# Altium schematic sheet 4_Port_多余的.schdoc.schdoc
size 302 x 215 mm; Name: A_A4; Symbol: A_A4; Device: A_A4; @Project Name: 0117_230627_uMSX 4.0; REV: 1.0; Date: 2023-01-30; Sheet: 1/1; Draw By: Denjhang; Company: Your Company; Convert to PCB: yes; Add into BOM: yes
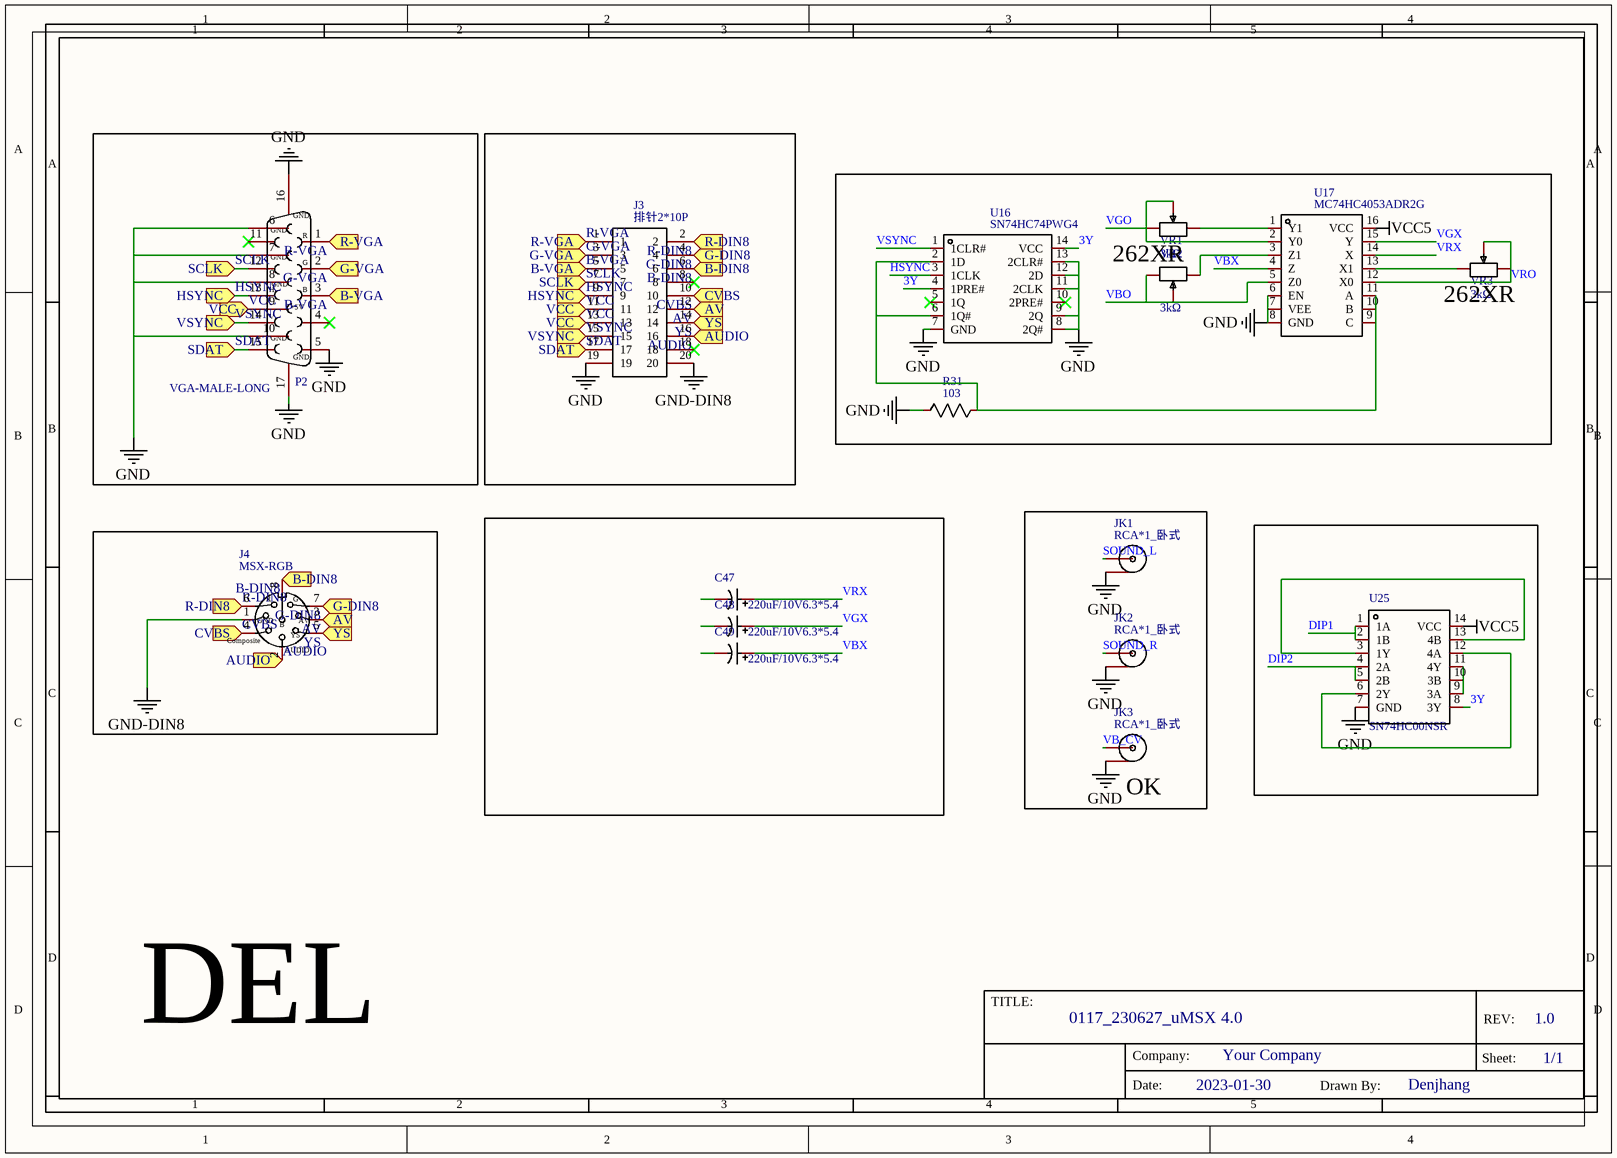
[diagram p0: 4_Port_多余的.schdoc.schdoc]

## Parts
C47  220uF/10V6.3*5.4  [CAP-SMD_BD6.3-L6.6-W6.6-LS7.2-FD]
C48  220uF/10V6.3*5.4  [CAP-SMD_BD6.3-L6.6-W6.6-LS7.2-FD]
C49  220uF/10V6.3*5.4  [CAP-SMD_BD6.3-L6.6-W6.6-LS7.2-FD]
J3  排针2*10P  [排针2*10P]
J4  MSX-RGB  [MSX-RGB]
JK1  RCA*1_卧式  [RCA*1卧式]
JK2  RCA*1_卧式  [RCA*1卧式]
JK3  RCA*1_卧式  [RCA*1卧式]
P2  VGA-MALE-LONG  [VGA-MALE-LONG]
R31  103  [R0603]
U16  SN74HC74PWG4  [SOP-14_L8.6-W3.9-P1.27-LS6.0-BL]
U17  MC74HC4053ADR2G  [SOP-16_L10.2-W3.9-P1.27-LS6.0-BL]
U25  SN74HC00NSR  [SOP-14_L8.6-W3.9-P1.27-LS6.0-BL]
VR1  3kΩ  [RES-ADJ-SMD_3P-L3.10-W3.80-P1.00]
VR2  3kΩ  [RES-ADJ-SMD_3P-L3.10-W3.80-P1.00]
VR3  3kΩ  [RES-ADJ-SMD_3P-L3.10-W3.80-P1.00]

## Blocks framed on the sheet
OK: JK1-JK3

## Ports
AUDIO (in), AV (in), B-DIN8 (in), B-VGA (in), CVBS (in), G-DIN8 (in), G-VGA (in), HSYNC (in), R-DIN8 (in), R-VGA (in), SCLK (in), SDAT (in), VCC (in), VSYNC (in), YS (in)

## Nets
GND: J3.19 JK1.3 JK2.3 JK3.3 P2.5 P2.6 P2.7 P2.8 P2.10 P2.16 P2.17 R31.1 U16.7(GND) U16.8(2Q#) U16.9(2Q) U16.11(2CLK) U16.12(2D) U16.13(2CLR#) U17.6(EN) U17.7(VEE) U17.8(GND) U25.7(GND)
GND-DIN8: J3.20 J4.1
VCC5: U17.16(VCC) U25.14(VCC)
3Y: U16.4(1PRE#) U16.14(VCC) U25.8(3Y)
AUDIO: J3.16 J4.2 ; port AUDIO
AV: J3.12 J4.3 ; port AV
B-DIN8: J3.6 J4.8 ; port B-DIN8
B-VGA: J3.5 P2.3 ; port B-VGA
CVBS: J3.10 J4.4 ; port CVBS
DIP1: U25.1(1A) U25.2(1B)
DIP2: U25.4(2A) U25.5(2B)
G-DIN8: J3.4 J4.7 ; port G-DIN8
G-VGA: J3.3 P2.2 ; port G-VGA
HSYNC: J3.9 P2.13 U16.3(1CLK) ; port HSYNC
R-DIN8: J3.2 J4.6 ; port R-DIN8
R-VGA: J3.1 P2.1 ; port R-VGA
SCLK: J3.7 P2.12 ; port SCLK
SDAT: J3.17 P2.15 ; port SDAT
SOUND_L: JK1.2
SOUND_R: JK2.2
VB_CV: JK3.2
VBO: U17.5(Z0) VR2.a VR2.b
VBX: C49.1 U17.4(Z)
VCC: J3.11 J3.13 P2.9 ; port VCC
VGO: U17.2(Y0) VR1.b VR1.c
VGX: C48.1 U17.15(Y)
VRO: U17.12(X0) VR3.a VR3.b
VRX: C47.1 U17.14(X)
VSYNC: J3.15 P2.14 U16.1(1CLR#) ; port VSYNC
YS: J3.14 J4.5 ; port YS
NetR31_2: R31.2 U16.2(1D) U16.6(1Q#) U17.9(C) U17.10(B) U17.11(A)
NetU17_1: U17.1(Y1) VR1.a
NetU17_3: U17.3(Z1) VR2.c
NetU17_13: U17.13(X1) VR3.c
NetU25_3: U25.3(1Y) U25.13(4B)
NetU25_6: U25.6(2Y) U25.12(4A)
NetU25_9: U25.9(3A) U25.10(3B) U25.11(4Y)

Not connected (* = marked no-connect by the designer): C47 2; C48 2; C49 2; J3 8* 18*; P2 4* 11*; U16 5(1Q)* 10(2PRE#)*

## Notes on the sheet
- 262XR
- (near VR3) 262XR
- DEL
- 1
- 2
- 3
- 4
- 5
- A
- B
- C
- D
- TITLE:
- 0117_230627_uMSX 4.0
- REV:
- 1.0
- Date:
- Company:
- 2023-01-30
- Your Company
- Drawn By:
- Denjhang
- Sheet:
- 1/1
- (in symbol MSX-RGB) R; G; GND; AV; B; YS; Composite; AUDIO
- (in symbol VGA-MALE-LONG) GND; R; G; H; B; +5V; V

## Library data of the parts
C47-C49 = 固态电容220uF/10V6.3*5.4: Add into BOM: yes; Name: 220uF/10V6.3*5.4; Symbol: 固态电容220UF/10V6.3*5.4; Device: 固态电容220uF/10V6.3*5.4; LCSC Part Name: 固态电容220uF/10V6.3*5.4; Supplier Part: C9900001736; Manufacturer Part: 220uF/10V6.3*5.4; Supplier Footprint: CAP-SMD_6.3X5.4; JLCPCB Part Class: Extended Part; Datasheet: https://atta.szlcsc.comnull; Supplier: LCSC; Convert to PCB: yes
J3 = 排针2*10P: Convert to PCB: yes; Name: 排针2*10P; Symbol: 排针2*10P; Device: 排针2*10P; Add into BOM: yes; Origin Footprint: 排针2*10P
J4 = MSX-RGB: Convert to PCB: yes; Name: MSX-RGB; Symbol: MSX-RGB; Device: MSX-RGB; Add into BOM: yes; Origin Footprint: MSX-RGB
JK1-JK3 = RCA*1_卧式: 3DModel: rca座; Add into BOM: yes; Name: RCA*1_卧式; Symbol: RCA*1_卧式; Device: RCA*1_卧式; Convert to PCB: yes; Origin Footprint: RCA*1卧式
P2 = VGA-MALE-LONG: Convert to PCB: yes; Name: VGA-MALE-LONG; Symbol: VGA-MALE-LONG; Device: VGA-MALE-LONG; Add into BOM: yes; Origin Footprint: VGA-MALE-LONG
R31 = 103: 3DModel: R0603_L1.6-W0.8-H0.8; Add into BOM: yes; Name: 103; Symbol: 103; Device: 103; link: https://www.mouser.in/datasheet/2/447/PYu_RT_1_to_0_01_RoHS_L_11-1669912.pdf; Convert to PCB: yes; Origin Footprint: R0603
U16 = SN74HC74PWG4: Manufacturer: TI(德州仪器); 3DModel: TSSOP-14_L5.0-W4.4-H1.0-LS6.4-P0.65; Add into BOM: yes; Origin Footprint: TSSOP-14_L5.0-W4.4-P0.65-LS6.5-BL; Name: SN74HC74PWG4; Symbol: SN74HC74PWG4; Device: SN74HC74PWG4; Supplier: LCSC; Supplier Part: C1550112; Manufacturer Part: SN74HC74PWG4; Convert to PCB: yes
U17 = MC74HC4053ADR2G: Manufacturer: onsemi(安森美); 3DModel: SOIC-16_L9.9-W3.9-H1.8-LS6.0-P1.27; Add into BOM: yes; Origin Footprint: SOIC-16_L9.9-W3.9-P1.27-LS6.0-BL; Name: MC74HC4053ADR2G; Symbol: MC74HC4053ADR2G; Device: MC74HC4053ADR2G; link: http://datasheet.octopart.com/MC14076BDR2G-ON-Semiconductor-datasheet-608107.pdf; Supplier: LCSC; Supplier Part: C233611; Manufacturer Part: MC74HC4053ADR2G; JLCPCB Part Class: Extended Part; Convert to PCB: yes
U25 = SN74HC00NSR: Manufacturer: TI(德州仪器); Add into BOM: yes; Logic Gate Type: 与非门; Description: 逻辑电路的归属系列:74HC;逻辑类型:与非门;; Name: SN74HC00NSR; Symbol: SN74HC00NSR; Device: SN74HC00NSR; LCSC Part Name: 与非门; Supplier Part: C6808; Manufacturer Part: SN74HC00NSR; Supplier Footprint: SOIC-14; JLCPCB Part Class: Extended Part; Datasheet: https://atta.szlcsc.com/upload/public/pdf/source/20140704/1457707111726.pdf; Supplier: LCSC; Convert to PCB: yes; Series: 74HC
VR1-VR3 = EVM3ESX50B33: Manufacturer: PANASONIC(松下); Add into BOM: yes; Tolerance: ±25%; Description: 阻值:3kΩ;精度:±25%;; Name: 3kΩ; Symbol: EVM3ESX50B33; Device: EVM3ESX50B33; LCSC Part Name: 3KΩ ±25% ±250ppm/℃ 停产; Supplier Part: C11959; Manufacturer Part: EVM3ESX50B33; Supplier Footprint: SMD; JLCPCB Part Class: Extended Part; Datasheet: https://atta.szlcsc.com/upload/public/pdf/source/20180412/C11959_7A96476B9BBB540AE9953411E713845F.pdf; Supplier: LCSC; Convert to PCB: yes; Value: 3kΩ